# Altium schematic sheet 5  - Status Lights.SchDoc
size 330 x 228 mm
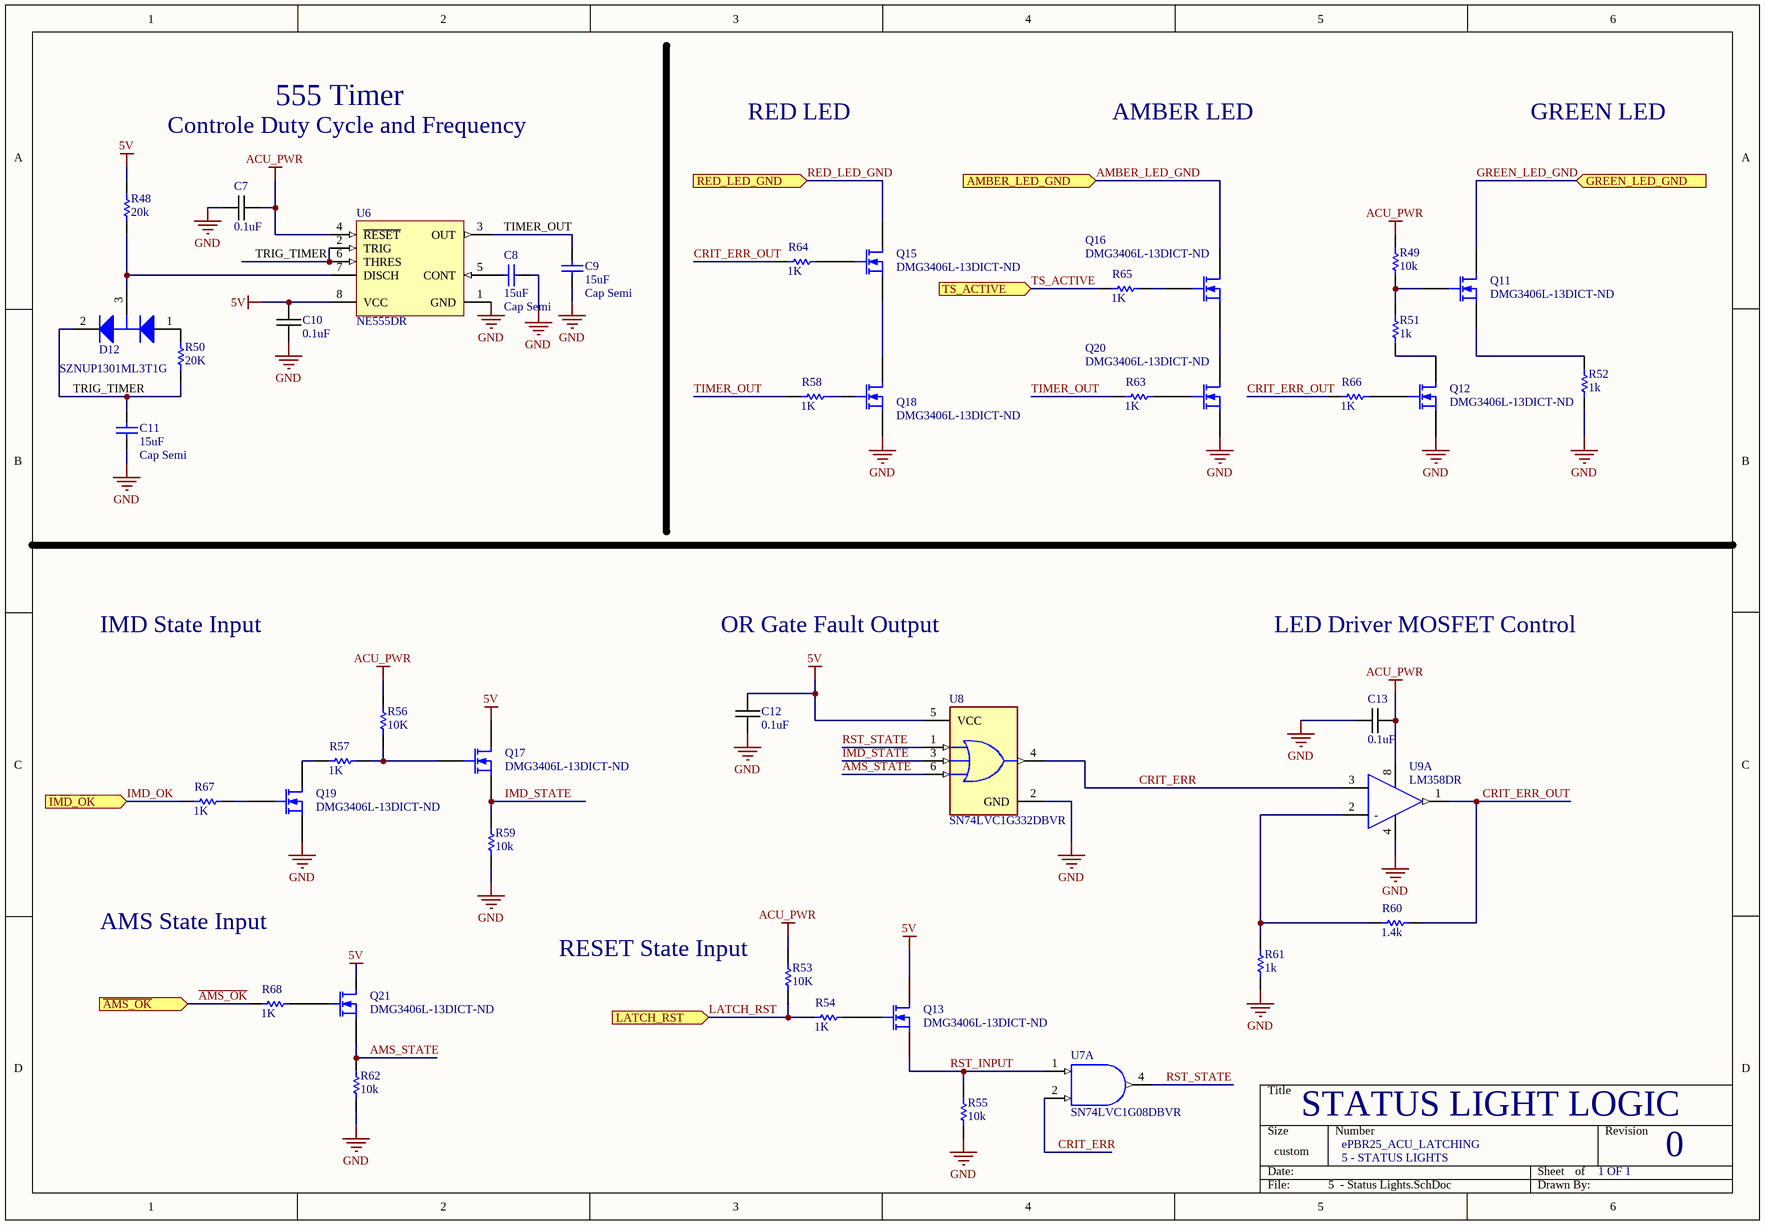
[diagram p0: 5  - Status Lights.SchDoc]

## Parts
C7  value 0.1uF  [1608[0603]]  (hidden comment: 100nF)
C8  Cap Semi  value 15uF  [1608[0603]]
C9  Cap Semi  value 15uF  [1608[0603]]
C10  value 0.1uF  [1608[0603]]  (hidden comment: 100nF)
C11  Cap Semi  value 15uF  [1608[0603]]
C12  value 0.1uF  [1608[0603]]  (hidden comment: 100nF)
C13  value 0.1uF  [1608[0603]]  (hidden comment: 100nF)
D12  SZNUP1301ML3T1G  [ONSC-SOT-23-3-318-08_V]
Q11  Supplier Part Number 1: DMG3406L-13DICT-ND  [SOT23-GDS]
Q12  Supplier Part Number 1: DMG3406L-13DICT-ND  [SOT23-GDS]
Q13  Supplier Part Number 1: DMG3406L-13DICT-ND  [SOT23-GDS]
Q15  Supplier Part Number 1: DMG3406L-13DICT-ND  [SOT23-GDS]
Q16  Supplier Part Number 1: DMG3406L-13DICT-ND  [SOT23-GDS]
Q17  Supplier Part Number 1: DMG3406L-13DICT-ND  [SOT23-GDS]
Q18  Supplier Part Number 1: DMG3406L-13DICT-ND  [SOT23-GDS]
Q19  Supplier Part Number 1: DMG3406L-13DICT-ND  [SOT23-GDS]
Q20  Supplier Part Number 1: DMG3406L-13DICT-ND  [SOT23-GDS]
Q21  Supplier Part Number 1: DMG3406L-13DICT-ND  [SOT23-GDS]
R48  20k  [RESC0603(1608)_L]
R49  10k  [RESC0603(1608)_L]
R50  20K  [RESC0603(1608)_L]
R51  1k  [RESC0603(1608)_L]
R52  1k  [RESC0603(1608)_L]
R53  10K  [RESC0603(1608)_L]
R54  1K  [RESC0603(1608)_L]
R55  10k  [RESC0603(1608)_L]
R56  10K  [RESC0603(1608)_L]
R57  1K  [RESC0603(1608)_L]
R58  1K  [RESC0603(1608)_L]
R59  10k  [RESC0603(1608)_L]
R60  1.4k  [RESC0603(1608)_L]
R61  1k  [RESC0603(1608)_L]
R62  10k  [RESC0603(1608)_L]
R63  1K  [RESC0603(1608)_L]
R64  1K  [RESC0603(1608)_L]
R65  1K  [RESC0603(1608)_L]
R66  1K  [RESC0603(1608)_L]
R67  1K  [RESC0603(1608)_L]
R68  1K  [RESC0603(1608)_L]
U6  NE555DR  [D0008A_M]
U7  SN74LVC1G08DBVR  [DBV0005A_M]  (part A of 2)
U8  SN74LVC1G332DBVR  [FP-DBV0006A-MFG]
U9  LM358DR  [FP-D0008A-MFG]  (part A of 2)

## Ports
AMBER_LED_GND (in), GREEN_LED_GND (in), IMD_OK (in), LATCH_RST (in), RED_LED_GND (in), TS_ACTIVE (in), ~{AMS_OK} (in)

## Nets
5V: C10.2 C12.1 Q13.3(D) Q17.3(D) Q21.3(D) R48.1 U6.8(VCC) U8.5(VCC)
ACU_PWR: C7.1 C13.2 R49.1 R53.2 R56.2 U6.4(~{RESET}) U9.8(V+)
GND: C7.2 C8.1 C9.2 C10.1 C11.2 C12.2 C13.1 Q12.2(S) Q18.2(S) Q19.2(S) Q20.2(S) R52.1 R55.2 R59.2 R61.2 R62.2 U6.1(GND) U8.2(GND) U9.4(V-)
~{AMS_OK}: R68.1 ; port ~{AMS_OK}
AMBER_LED_GND: Q16.3(D) ; port AMBER_LED_GND
AMS_STATE: Q21.2(S) R62.1 U8.6(C)
CRIT_ERR: U7.2(B) U8.4(Y) U9.3(IN1+)
CRIT_ERR_OUT: R60.2 R64.1 R66.1 U9.1(1OUT)
GREEN_LED_GND: Q11.3(D) ; port GREEN_LED_GND
IMD_OK: R67.1 ; port IMD_OK
IMD_STATE: Q17.2(S) R59.1 U8.3(B)
LATCH_RST: R53.1 R54.1 ; port LATCH_RST
RED_LED_GND: Q15.3(D) ; port RED_LED_GND
RST_INPUT: Q13.2(S) R55.1 U7.1(A)
RST_STATE: U7.4(Y) U8.1(A)
TIMER_OUT: C9.1 R58.1 R63.1 U6.3(OUT)
TRIG_TIMER: C11.1 D12.2(K) R50.1 U6.2(TRIG) U6.6(THRES)
TS_ACTIVE: R65.1 ; port TS_ACTIVE
NetC8_2: C8.2 U6.5(CONT)
NetD12_1: D12.1(A) R50.2
NetD12_3: D12.3(K/A) R48.2 U6.7(DISCH)
NetQ11_1: Q11.1(G) R49.2 R51.2
NetQ11_2: Q11.2(S) R52.2
NetQ12_1: Q12.1(G) R66.2
NetQ12_3: Q12.3(D) R51.1
NetQ13_1: Q13.1(G) R54.2
NetQ15_1: Q15.1(G) R64.2
NetQ15_2: Q15.2(S) Q18.3(D)
NetQ16_1: Q16.1(G) R65.2
NetQ16_2: Q16.2(S) Q20.3(D)
NetQ17_1: Q17.1(G) R56.1 R57.2
NetQ18_1: Q18.1(G) R58.2
NetQ19_1: Q19.1(G) R67.2
NetQ19_3: Q19.3(D) R57.1
NetQ20_1: Q20.1(G) R63.2
NetQ21_1: Q21.1(G) R68.2
NetR60_1: R60.1 R61.1 U9.2(IN1-)

## Notes on the sheet
- Controle Duty Cycle and Frequency
- 555 Timer
- RED LED
- AMBER LED
- GREEN LED
- IMD State Input
- OR Gate Fault Output
- LED Driver MOSFET Control
- AMS State Input
- (near R53) RESET State Input
- STATUS LIGHT LOGIC
- ePBR25_ACU_LATCHING
- 5 - STATUS LIGHTS
- 1 OF 1
- 0
- (in symbol CMP-1685-00009-2, part A) -

## Library data of the parts
C7 C10 C12 C13 = 0805C-100nF-25V-X7R-MUR: CAP CER 0.1UF 50V X7R 0603; Manufacturer: Kemet; Manufacturer Part Number: C0603C104K5RACAUTO; Capacitance: 0.1µF; Tolerance: ±10%; Supplier 1: Digi-Key; Supplier Part Number 1: 399-6856-1-ND; RoHS: RoHS Compliant; Category: Capacitors; Stock 1: 157876; Pricing 1: 1=0.14, 10=0.095, 25=0.0672, 50=0.0514, 100=0.0435, 250=0.03556, 1000=0.02324 (CAD); Packaging: Cut Tape (CT); Voltage - Rated: 50V; Temperature Coefficient: X7R; Mounting Type: Surface Mount, MLCC; Operating Temperature: -55°C ~ 125°C; Applications: Automotive; Ratings: AEC-Q200; Package / Case: 0603 (1608 Metric); Size / Dimension: 0.063" L x 0.031" W (1.60mm x 0.80mm); Height - Seated (Max): -; Thickness (Max): 0.034" (0.87mm); Lead Spacing: -; Features: -; Lead Style: -; ComponentLink1URL: http://capacitoredge.kemet.com/capedge2/DataSheet?pn=C0603C104K5RACAUTO; ComponentLink1Description: http://capacitoredge.kemet.com/capedge2/DataSheet?pn=C0603C104K5RACAUTO
C8 C9 C11 = Cap Semi: Capacitor (Semiconductor SIM Model); Published: 8-Jun-2000; LatestRevisionDate: 29-May-2009; LatestRevisionNote: IPC-7351 Footprint Added.; PackageReference: C1206; Publisher: Altium Limited; PackageDescription: Chip Capacitor
D12 = CMP-1063-00171-1: Low Capacitance Diode Array for ESD Protection in a Single Data Line, 3-Pin SOT-23, Pb-Free, Tape and Reel; Manufacturer: On Semiconductor; C Max (pF): 0.9; Direction: Bidirectional; V(BR) Min (V): 70; Number of Lines: 1; Mounting Technology: Surface Mount; PackageReference: SOT-23-3-318-08; DatasheetVersion: Rev. 6; PackageVersion: Rev. AP, 11/2009; RoHS: Pb-Free; ComponentLink1Description: Manufacturer URL; ComponentLink1URL: http://www.onsemi.com/; PackageDescription: 3-Pin Small Outline Transistor, Body 2.92 x 1.3 mm, Pitch 0.95 mm; PartNumber: SZNUP1301ML3T1G; Packing: Tape and Reel; ComponentLink3URL: http://www.onsemi.cn/pub_link/Collateral/318-08.PDF; ComponentLink3Description: Package Specification; VRWM Max (V): 70; ComponentLink2Description: Datasheet; ComponentLink2URL: http://www.onsemi.cn/pub_link/Collateral/NUP1301ML3T1-D.PDF; Supplier 1: Digi-Key; Supplier Part Number 1: SZNUP1301ML3T1GOSCT-ND
Q11-Q13 Q15-Q21 = MOSFET-N: N-Channel MOSFET; Manufacturer: Infineon Technologies; FET Type: MOSFET N-Channel, Metal Oxide; FET Feature: Logic Level Gate; Drain to Source Voltage (Vdss): 30V; Current - Continuous Drain (Id) @ 25°C: 50A (Tc); Rds On (Max) @ Id, Vgs: 7.5 mOhm @ 30A, 10V; Vgs(th) (Max) @ Id: 2.2V @ 250µA; Gate Charge (Qg) @ Vgs: 18nC @ 10V; Input Capacitance (Ciss) @ Vds: 1900pF @ 15V; Power - Max: 47W; Published: 8-Jun-2000; LatestRevisionDate: 17-Jul-2002; LatestRevisionNote: Re-released for DXP Platform.; PackageVersion: 1995/1996; PackageReference: E3; Publisher: Altium Limited; PackageDescription: TO, Flat Index; 3 In-Line, Axial Leads; Body Dia. 4.6mm; Lead Dia. 0.5 mm (max); RoHS: RoHS Compliant; Category: Discrete Semiconductor Products; Packaging: Cut Tape (CT); Mounting Type: Surface Mount; Package / Case: TO-252-3, DPak (2 Leads + Tab), SC-63; Supplier Device Package: PG-TO252-3; ComponentLink1URL: http://www.infineon.com/dgdl/Infineon-IPD075N03LG-DS-v02_01-en.pdf?folderId=5546d4694909da4801490a07012f053b&fileId=db3a30431936bc4b011951d824f83aeb; ComponentLink1Description: http://www.infineon.com/dgdl/Infineon-IPD075N03LG-DS-v02_01-en.pdf?folderId=5546d4694909da4801490a07012f053b&fileId=db3a30431936bc4b011951d824f83aeb; ComponentLink2URL: http://www.semicon.toshiba.co.jp/info/docget.jsp?type=datasheet&lang=en&pid=SSM3K329R; ComponentLink2Description: http://www.semicon.toshiba.co.jp/info/docget.jsp?type=datasheet&lang=en&pid=SSM3K329R; Supplier 1: Digi-Key
R48-R50 R53 R55 R56 R59 R60 R62 = CMP-1591-00001-1: 0603 (1608 Metric) Chip Resistor; Value: 1k; Case-Metric: 1608; Case-EIA: 0603; PackageReference: RESC0603(1608); Supplier 1: Digi-Key
  R48: Supplier Part Number 1: 311-10KGRCT-ND
  R49 R53 R55 R56 R59 R60 R62: Supplier Part Number 1: 311-1.0KGRCT-ND
  R50: Supplier Part Number 1: 311-27KGRCT-ND
R51 R52 R54 R57 R58 R61 R63-R68 = CMP-1591-00001-1: 0603 (1608 Metric) Chip Resistor; Case-Metric: 1608; Case-EIA: 0603; Value: 1k; PackageReference: RESC0603(1608); Supplier 1: Digi-Key; Supplier Part Number 1: 311-1.0KGRCT-ND
U6 = CMP-1685-00007-1: Precision Timer, 4.5 to 16 V, 0 to 70 degC, 8-Pin SOIC (D8), Green (RoHS & no Sb/Br), Tape and Reel; Forward Voltage: 450 mV; Forward Current: 1 A; Max Surge Current: 30 A; Peak Reverse Current: 500 uA; Case\Package: SMA; PackageReference: D0008A; Width: 2.84 mm; PackageDescription: 8-Pin Small Outline Integrated Circuit, Body 4.9 x 3.9 mm, Pitch 1.27 mm; DatasheetVersion: SLFS022I, 09/2014; ComponentLink2Description: Datasheet; Package Quantity: 1; REACH SVHC: Unknown; Radiation Hardening: No; Height: 2.44 mm; Code_JEDEC: MS-012; Pins: 2; ComponentLink1Description: Manufacturer URL; ComponentLink3Description: Package Specification; ComponentLink3URL: http://www.ti.com/lit/ml/msoi002j/msoi002j.pdf; Length: 4.57 mm; ComponentLink1URL: http://www.ti.com/; Mount: Surface Mount; PackageVersion: 4040047-3/M, 06/2011; ComponentLink2URL: http://www.ti.com/general/docs/lit/getliterature.tsp?genericPartNumber=NE555&fileType=pdf; RoHSCompliant: true; Max Operating Temperature: 125 degC; Packaging: Cut Tape; Min Operating Temperature: -55 degC; Supplier 1: Digi-Key; Supplier Part Number 1: 296-6501-2-ND
U7 = CMP-0859-00053-3: Single 2-Input Positive-AND Gate, DBV0005A, LARGE T&R; Manufacturer: Texas Instruments; Logic: True; ICC @ Nom Voltage(Max)(mA): 0.01; VCC(Min)(V): 1.65; Bits(#): 1; Rating: Catalog; Schmitt Trigger: No; Voltage(Nom)(V): 1.8,2.5,3.3,5; Output Drive (IOL/IOH)(Max)(mA): 32/-32; Gate Type: AND; tpd @ Nom Voltage(Max)(ns): 4.5,6,4,5; VCC(Max)(V): 5.5; Output Type: CMOS; F @ Nom Voltage(Max)(Mhz): 150; Input Type: CMOS/TTL; Technology Family: LVC; Sub-Family: AND Gate; PackageReference: DBV0005A; Generic Part Number: SN74LVC1G08; Operating Temperature Range(C): -40 to 125,-40 to 85; 3-State Output: No; DatasheetVersion: SCES217Y
U8 = CMP-0859-00188-4: IC GATE OR 1CH 3-INP SOT23-6; Manufacturer: TEXAS INSTRUMENTS; Number Of Inputs: 3; Nominal Supply Current: 10-500uA; Number Of Circuits: 1; Max Supply Voltage: 5.5V; Standoff Height: 0mm; Propagation Delay: 4.5ns; Min Supply Voltage: 1.5V; Height: 1.45mm; Temperature Range High: +125°C; Device Class L3: Logic Gates; Device Class L2: Logic ICs; Lead Free: Yes; Temperature Range Low: -40°C; ComponentLink2URL: http://www.ti.com/lit/ds/symlink/sn74lvc1g332.pdf; Package: DBV0006A; ComponentLink2Description: Datasheet; Octopart: https://octopart.com/sn74lvc1g332dbvr-texas+instruments-464996; Category: IC; Automotive: No; Manufacturer Part Number: SN74LVC1G332DBVR; Ipc Land Pattern Name: SOT95P280X145-6; Logic Function Desc: OR; Ambient Temperature Range Low: -40°C; Temperature: -40°C to +125°C; Number Of Outputs: 1; Mouser Description: Logic Gates Sngl 3 Inpt + OR Gt; RoHS: TRUE; Ambient Temperature Range High: +125°C; Device Class L1: Integrated Circuits (ICs); Digikey Description: IC GATE OR 1CH 3-INP SOT23-6
U9 = CMP-1685-00009-2: IC OPAMP GP 2 CIRCUIT 8SOIC; Output Current: 30mA; Min Dual Supply Voltage: 1.5V; Input Offset Voltage (Vos): 7mV; Power Supply Rejection Ratio (PSRR): 65dB; Unity Gain Bandwidth Product: 700kHz; Number of Channels: 2; Min Supply Voltage: 3V; Max Dual Supply Voltage: 16V; Dual Supply Voltage: 9V; Max Supply Voltage: 32V; Nominal Supply Current: 1.2mA; Slew Rate: 0.3V/µs; Input Bias Current: 250nA; Voltage Gain: 100dB; Operating Supply Current: 1mA; REACH SVHC: No SVHC; Package Quantity: 2500; Width: 3.91mm; Max Operating Temperature: 70°C; Min Operating Temperature: 0°C; Mount: Surface Mount; Length: 4.9mm; Radiation Hardening: No; Case/Package: SOIC; Lead Free: Lead Free; Number of Elements: 2; Packaging: Tape and Reel; Output Current per Channel: 30mA; Number of Circuits: 2; Bandwidth: 700kHz; Operating Supply Voltage: 16V; Gain Bandwidth Product: 700kHz; Number of Pins: 8; Number of Amplifiers: 2; Height: 1.58mm; Common Mode Rejection Ratio: 65dB; Contact Plating: Gold